# Altium schematic sheet Rat Social Box Extension.SchDoc
size 297 x 209 mm; CompanyName: Sainsbury Wellcome Centre; Organization: FabLab; Address1: Sainsbury Wellcome Centre; Address2: 25 Howland Street; Address3: London; Address4: W1T 4JG; DocumentNumber: 1; SheetNumber: 1; SheetTotal: 5; swcgroup: FabLab; Org: Sainsbury Wellcome Centre; Add1: 25 Howland Street; Add2: London; Add3: W1T 4JG; WebAddress: www.sainsburywellcome.org; SheetSize: A4
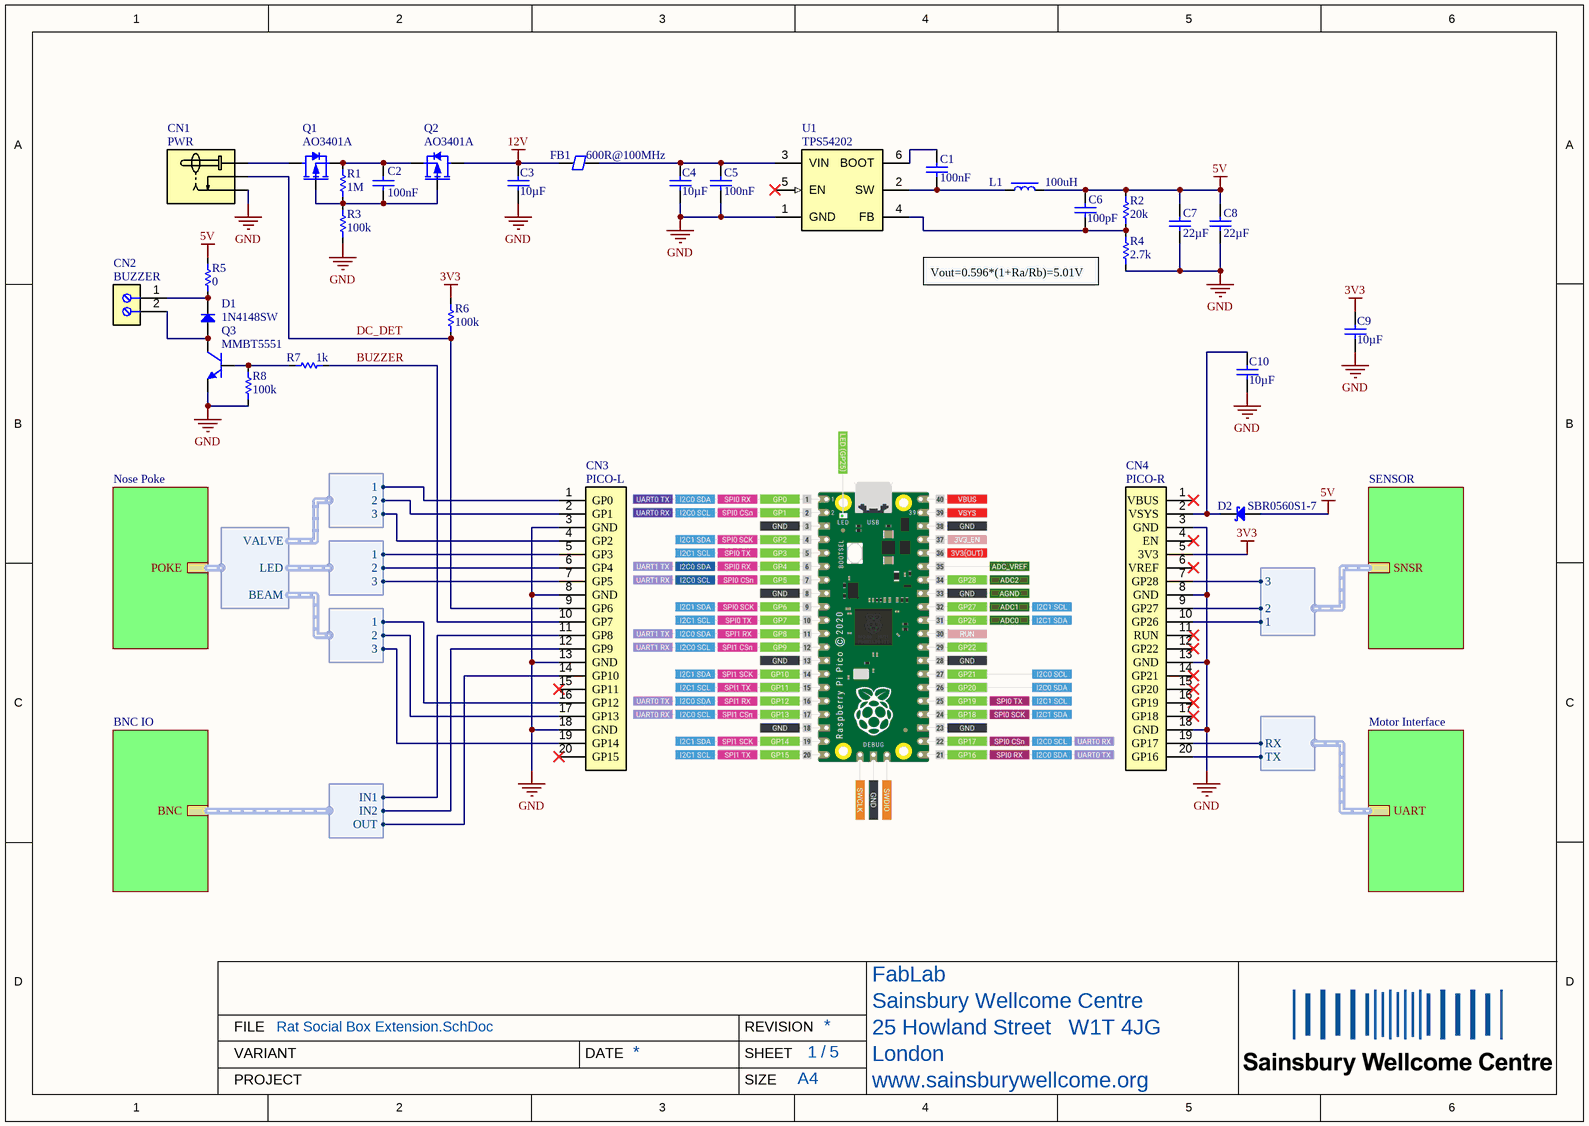
[diagram p0: Rat Social Box Extension.SchDoc]

## Parts
C1  value 100nF  [CAP_CHIP_0603]  (hidden comment: C0603-100nF-50V)
C2  value 100nF  [CAP_CHIP_0603]  (hidden comment: C0603-100nF-50V)
C3  value 10µF  [CAP_CHIP_0603]  (hidden comment: C0603-10uF-25V)
C4  value 10µF  [CAP_CHIP_0603]  (hidden comment: C0603-10uF-25V)
C5  value 100nF  [CAP_CHIP_0603]  (hidden comment: C0603-100nF-50V)
C6  value 100pF  [CAP_CHIP_0603]  (hidden comment: C0603-100pF-50V)
C7  value 22µF  [CAP_CHIP_0603]  (hidden comment: C0603-22uF-6V3)
C8  value 22µF  [CAP_CHIP_0603]  (hidden comment: C0603-22uF-6V3)
C9  value 10µF  [CAP_CHIP_0603]  (hidden comment: C0603-10uF-25V)
C10  value 10µF  [CAP_CHIP_0603]  (hidden comment: C0603-10uF-25V)
CN1  PWR  [DC-005-2.0]
CN2  BUZZER  [TH-5.00-1X2P]
CN3  PICO-L  [FM_2.54_1X20P]
CN4  PICO-R  [FM_2.54_1X20P]
D1  1N4148SW  [SOD323]
D2  SBR0560S1-7  [SOD123]
FB1  value 600R@100MHz  [FB_CHIP_0805]  (hidden comment: FB0805-600R-0.5A)
L1  value 100uH  [IND_PWR_0402L]  (hidden comment: L-PWR-100uH-0.26A)
Q1  AO3401A  [SOT23]
Q2  AO3401A  [SOT23]
Q3  MMBT5551  [SOT23]
R1  value 1M  [RES_CHIP_0603]  (hidden comment: R0603-1M)
R2  value 20k  [RES_CHIP_0603]  (hidden comment: R0603-20K)
R3  value 100k  [RES_CHIP_0603]  (hidden comment: R0603-100K)
R4  value 2.7k  [RES_CHIP_0603]  (hidden comment: R0603-2K7)
R5  value 0  [RES_CHIP_1206]  (hidden comment: R1206-0R)
R6  value 100k  [RES_CHIP_0603]  (hidden comment: R0603-100K)
R7  value 1k  [RES_CHIP_0603]  (hidden comment: R0603-1K)
R8  value 100k  [RES_CHIP_0603]  (hidden comment: R0603-100K)
U1  TPS54202  [SOT23-6]

## Sub-sheets
BNC IO = BNC IO.SchDoc: BNC (harness BNC)
Motor Interface = Motor Interface.SchDoc: UART (harness UART)
Nose Poke = Nose Poke.SchDoc: POKE (harness POKE)
SENSOR = Sensor.SchDoc: SNSR (harness SNSR)

## Harnesses
UART: TX, RX
SNSR: 3, 2, 1
POKE: VALVE, LED, BEAM
VALVE: 1, 2, 3
LED: 1, 2, 3
BEAM: 1, 2, 3
BNC: IN1, IN2, OUT

## Nets
3V3: C9.2 CN4.5(3V3) R6.2
5V: C6.2 C7.2 C8.2 D2.2(A) L1.2 R2.2 R5.2
12V: C3.2 FB1.1 Q2.3(D)
GND: C3.1 C4.1 C5.1 C7.1 C8.1 C9.1 C10.1 CN1.2(Ring) CN3.3(GND) CN3.8(GND) CN3.13(GND) CN3.18(GND) CN4.3(GND) CN4.8(GND) CN4.13(GND) CN4.18(GND) Q3.2(E) R3.1 R4.1 R8.1 U1.1(GND)
BUZZER: CN3.10(GP7) R7.2
DC_DET: CN1.3(Detect) CN3.9(GP6) R6.1
NetC1_1: C1.1 L1.1 U1.2(SW)
NetC1_2: C1.2 U1.6(BOOT)
NetC2_1: C2.1 Q1.1(G) Q2.1(G) R1.1 R3.2
NetC2_2: C2.2 Q1.2(S) Q2.2(S) R1.2
NetC4_2: C4.2 C5.2 FB1.2 U1.3(VIN)
NetC6_1: C6.1 R2.1 R4.2 U1.4(FB)
NetC10_2: C10.2 CN4.2(VSYS) D2.1(C)
NetCN1_1: CN1.1(Center) Q1.3(D)
NetCN2_1: CN2.1 D1.1(K) R5.1
NetCN2_2: CN2.2 D1.2(A) Q3.3(C)
NetCN3_1: CN3.1(GP0) ; harness VALVE.1
NetCN3_2: CN3.2(GP1) ; harness VALVE.2
NetCN3_4: CN3.4(GP2) ; harness VALVE.3
NetCN3_5: CN3.5(GP3) ; harness LED.1
NetCN3_6: CN3.6(GP4) ; harness LED.2
NetCN3_7: CN3.7(GP5) ; harness LED.3
NetCN3_11: CN3.11(GP8) ; sheet BNC IO/BNC.IN1
NetCN3_12: CN3.12(GP9) ; sheet BNC IO/BNC.IN2
NetCN3_14: CN3.14(GP10) ; sheet BNC IO/BNC.OUT
NetCN3_16: CN3.16(GP12) ; harness BEAM.1
NetCN3_17: CN3.17(GP13) ; harness BEAM.2
NetCN3_19: CN3.19(GP14) ; harness BEAM.3
NetCN4_7: CN4.7(GP28) ; sheet SENSOR/SNSR.3
NetCN4_9: CN4.9(GP27) ; sheet SENSOR/SNSR.2
NetCN4_10: CN4.10(GP26) ; sheet SENSOR/SNSR.1
NetCN4_19: CN4.19(GP17) ; sheet Motor Interface/UART.RX
NetCN4_20: CN4.20(GP16) ; sheet Motor Interface/UART.TX
NetQ3_1: Q3.1(B) R7.1 R8.2

Not connected (* = marked no-connect by the designer): CN3 15(GP11)* 20(GP15)*; CN4 1(VBUS)* 4(EN)* 6(VREF)* 11(RUN)* 12(GP22)* 14(GP21)* 15(GP20)* 16(GP19)* 17(GP18)*; U1 5(EN)*

## Notes on the sheet
- Vout=0.596*(1+Ra/Rb)=5.01V
- FILE
- VARIANT
- DATE
- REVISION
- SHEET
- /
- PROJECT
- SIZE

## Library data of the parts
C1 C5 = CMP-611-0027-24: 0603 Multilayer Ceramic Capacitors MLCC; PartNumber: CC0603KRX7R9BB104; Tolerance: 10%; Pick&PlaceFootprint: C0603; Dielectric: X7R; Voltage Rating: 50V; Capacitor Type: Ceramic; RoHS: Yes; Mount: SMD; LCSC Part N.: C14663; Case/Package: 0603
C2 = CMP-611-0027-24: 0603 Multilayer Ceramic Capacitors MLCC; PartNumber: CC0603KRX7R9BB104; Pick&PlaceFootprint: C0603; Dielectric: X7R; Voltage Rating: 50V; Tolerance: 10%; Case/Package: 0603; Capacitor Type: Ceramic; LCSC Part N.: C14663; Mount: SMD; RoHS: Yes
C3 C4 C9 C10 = CMP-611-0050-6: 0603 Multilayer Ceramic Capacitors MLCC; PartNumber: CL10A106MA8NRNC; Dielectric: X5R; Pick&PlaceFootprint: C0603; Voltage Rating: 25V; Tolerance: 20%; Case/Package: 0603; LCSC Part N.: C96446; RoHS: Yes; Capacitor Type: Ceramic; Mount: SMD
C6 = CMP-611-0038-6: 0603 Multilayer Ceramic Capacitors MLCC; PartNumber: CL10C101JB8NNNC; Pick&PlaceFootprint: C0603; Tolerance: 5%; Voltage Rating: 50V; Dielectric: C0G; Case/Package: 0603; LCSC Part N.: C14858; Capacitor Type: Ceramic; Mount: SMD; RoHS: Yes
C7 C8 = CMP-611-0054-4: 0603 Multilayer Ceramic Capacitors MLCC; PartNumber: CL10A226MQ8NRNC; Pick&PlaceFootprint: C0603; Dielectric: X5R; Voltage Rating: 6.3V; Tolerance: 20%; RoHS: Yes; Mount: SMD; Case/Package: 0603; Capacitor Type: Ceramic; LCSC Part N.: C59461
CN1 = CMP-360-0005-6: Surface Mount, Right Angle 2.5A 24V SMD DC Power Connector; PartNumber: DC-005-2.5A-2.0-SMT; Connector Type: Jack,Power; Pitch: 2.0mm; Gender: Male; Contact Plating: Tin; Voltage Rating: 24V; Contact Material: Copper Alloy; Current Rating: 2.5A; Mount: Surface Mount; LCSC Part N.: C2880543; Orientation: Horizontal
CN2 = CMP-00028-6: 1x2P 20A -40℃~+105℃ 250V Green 12~22 Direct Insert 5mm 2.5 1 2 Plugin,P=5mm Screw Terminal Blocks; PartNumber: WJ128V-5.0-2P; Gender: Male; Number of Positions: 2; Number of Rows: 1; LCSC Part N.: C8269; Pitch: 5mm; Mount: Thought Hole; Number of Contacts: 2; Orientation: Straight
CN3 CN4 = CMP-380-0017-2: 8.5mm Square Hole TH,P=2.54mm Female Headers; PartNumber: 22850120ANG1SYA01; Pitch: 2.54mm; Number of Positions: 20; Orientation: Straight; Gender: Female; Number of Contacts: 20; Number of Rows: 1; Mount: TH; LCSC Part N.: C429947
D1 = CMP-820-0007-2: 100V Single 1.25V@150mA 4ns 150mA SOD-323 Switching Diode; Forward Voltage: 1.25V; Mount: Surface Mount; Max Reverse Voltage: 100V; Pick&PlaceFootprint: SOD-323; Rectified Current: 150mA; LCSC Part N.: C2128; PartNumber: 1N4148SW
D2 = CMP-821-0014-2: Diode Schottky 60V 0.5A 2-Pin SOD-123 T/R; Rectified Current: 15A; Forward Voltage: 440mV; PartNumber: SBR0560S1-7; LCSC Part N.: C117950; Mount: Surface Mount; Max Reverse Voltage: 60V; Pick&PlaceFootprint: SOD123
FB1 = CMP-600-0000-6: Ferrite Chip, 1 Function(s), 0.5A, 2 Pin(s); PartNumber: GZ2012D601TF; DC Resistance-Max: 300mR; Current Rating: 500mA; Footprint: 0805; LCSC Part N.: C1017
L1 = CMP-620-0008-4: Inductor Power Shielded Wirewound 100uH 20% 100KHz Ferrite 450mA DCR 1515 Blister T/R; PartNumber: VLCF4020T-101MR26; Saturation Current: 260mA; DC Resistance (DCR): 1R4; LCSC Part N.: C20339; Tolerance: 20%; RMS Current (Irms): 450mA
Q1 Q2 = CMP-810-0003-2: 30V 4A 44mΩ@10V,4.3A 1.4W 1.3V@250uA 1 PChannel SOT-23-3L MOSFETs; RDS(ON): 44mR; Gate-Source Voltage (Vgs): 12V; Pick&PlaceFootprint: SOT-23; Drain Current (Id): -4A; Switching Time: 60ns; Drain-Source Voltage (Vds): -30V; Polarity: P Channel; Power Dissipation: 1.4W; LCSC Part N.: C15127; Mount: Surface Mount; PartNumber: AO3401A
Q3 = CMP-810-0000-7: 160V 300mW 200@10mA 5V 600mA NPN SOT-23 Bipolar Transistor; Collector-Base Voltage (VCBO): 180V; Transition Frequency: 100MHz; Emitter-Base Voltage  (VEBO): 6V; Power Dissipation: 300mW; Polarity: NPN; PartNumber: MMBT5551; Pick&PlaceFootprint: SOT-23; Collector Current (IC): 600mA; Mount: Surface Mount; LCSC Part N.: C2145; Collector-Emitter Voltage( VCEO): 160V
R1 = CMP-633-0066-20: 100mW Thick Film Resistors 75V ±100ppm/℃ ±1% 0603 Chip Resistor; PartNumber: 0603WAF1004T5E; Number of Resistors: 1; Pick&PlaceFootprint: R0603; Voltage Rating: 75V; Mount: Surface Mount; LCSC Part N.: C22935; Power Rating: 100mW; Tolerance: 1%; Case/Package: 0603
R2 = CMP-633-0126-1: 100mW Thick Film Resistors 75V ±100ppm/℃ ±1% 0603 Chip Resistor; PartNumber: 0603WAF2002T5E; Pick&PlaceFootprint: R0603; Number of Resistors: 1; Case/Package: 0603; Tolerance: 1%; Voltage Rating: 75V; Power Rating: 100mW; Mount: Surface Mount; LCSC Part N.: C4184
R3 R6 R8 = CMP-633-0000-28: 100mW Thick Film Resistors 75V ±100ppm/℃ ±1% 0603 Chip Resistor; PartNumber: 0603WAF1003T5E; Number of Resistors: 1; Pick&PlaceFootprint: R0603; LCSC Part N.: C25803; Mount: Surface Mount; Voltage Rating: 75V; Power Rating: 100mW; Case/Package: 0603; Tolerance: 1%
R4 = CMP-633-0031-25: 100mW Thick Film Resistors 75V ±100ppm/℃ ±1% 0603 Chip Resistor; PartNumber: 0603WAF2701T5E; Number of Resistors: 1; Pick&PlaceFootprint: R0603; Mount: Surface Mount; Power Rating: 100mW; Case/Package: 0603; Tolerance: 1%; Voltage Rating: 75V; LCSC Part N.: C13167
R5 = CMP-633-0050-10: 250mW Thick Film Resistors 200V ±800ppm/℃ ±1% 0Ω 1206 Chip Resistor; PartNumber: 1206W4F0000T5E; Number of Resistors: 1; Pick&PlaceFootprint: 1206; Tolerance: 1%; Power Rating: 250mW; Case/Package: 1206; Voltage Rating: 200V; LCSC Part N.: C17888; Mount: Surface Mount
R7 = CMP-633-0013-26: 100mW Thick Film Resistors 75V ±100ppm/℃ ±1% 0603 Chip Resistor; PartNumber: 0603WAF1001T5E; Pick&PlaceFootprint: R0603; Number of Resistors: 1; Voltage Rating: 75V; Case/Package: 0603; Tolerance: 1%; Mount: Surface Mount; LCSC Part N.: C21190; Power Rating: 100mW
U1 = CMP-970-0042-1: Switching Regulator, Current-mode, 2A, 500kHz Switching Freq-Max, PDSO6; PartNumber: TPS54202DDCR; Load Regulation: 0.1%; Max Output Voltage: 28V; Min Input Voltage: 4.5V; Switcher Configuration: BUCK; RDS(On): 148mR; Switching Frequency: 590kHz; Reference Voltage: 0.596V; Pick&PlaceFootprint: SOT23-6; Max Input Voltage: 28V; LCSC Part N.: C191884; Line Regulation: 0.1%; Max Output current: 2A